# EAGLE design ArduinoProMiniESP2866Adapter (EAGLE 9.4.2)
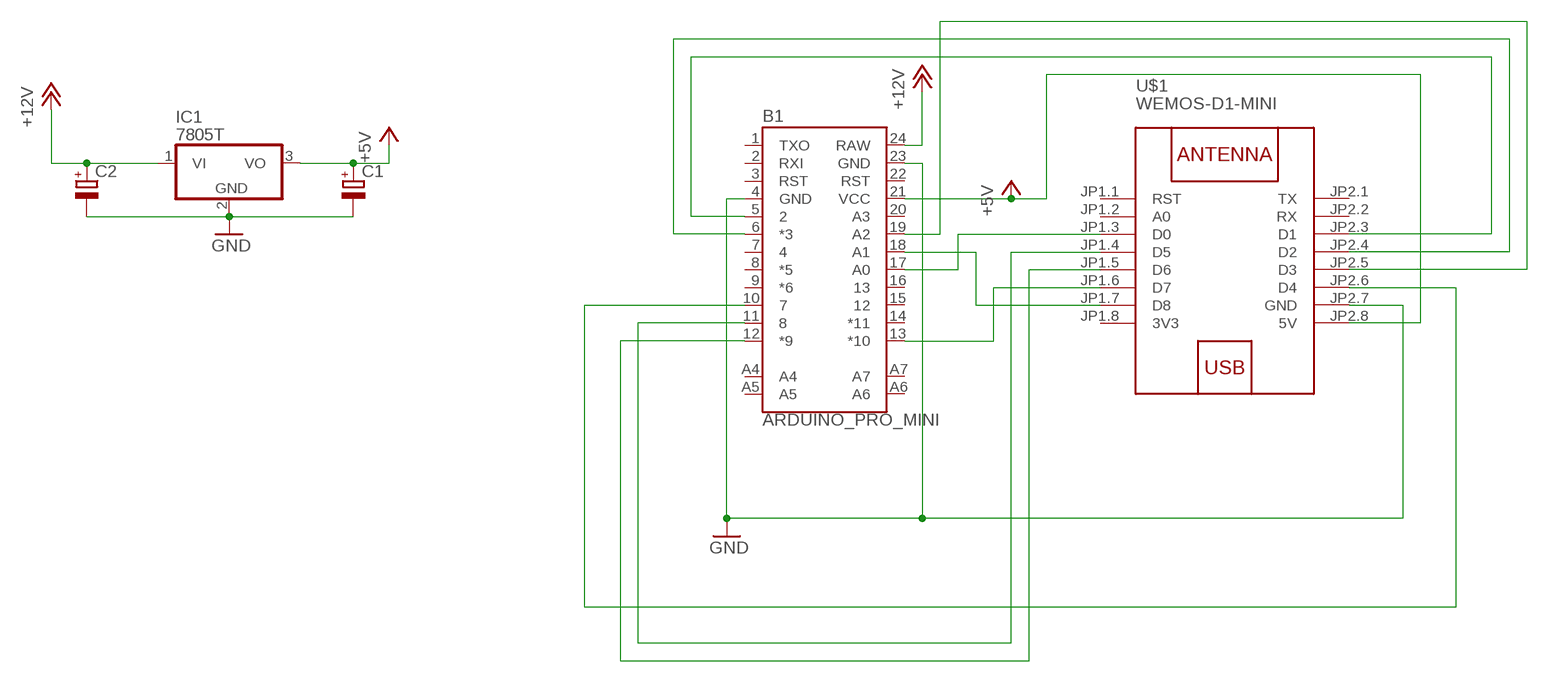
[diagram p0: schematic, sheet 1]

## Parts
B1  ARDUINO_PRO_MINI  [ARDUINO_PRO_MINI]
C1  CPOL-EUE2-4  [E2-4]
C2  CPOL-EUE2-4  [E2-4]
IC1  7805T  [TO220H]
U$1  WEMOS-D1-MINI  [WEMOS-D1-MINI]

## Nets
+5V: B1.21(VCC) C1.+ IC1.3(VO) U$1.JP2.8(5V)
+12V: B1.24(RAW) C2.+ IC1.1(VI)
GND: B1.4(GND) B1.23(GND) C1.- C2.- IC1.2(GND) U$1.JP2.7(GND)
N$1: B1.11 U$1.JP1.4(D5)
N$2: B1.12(*9) U$1.JP1.5(D6)
N$3: B1.13(*10) U$1.JP1.6(D7)
N$4: B1.5 U$1.JP2.3(D1)
N$5: B1.6(*3) U$1.JP2.4(D2)
N$6: B1.19(A2) U$1.JP2.5(D3)
N$7: B1.18(A1) U$1.JP1.7(D8)
N$8: B1.17(A0) U$1.JP1.3(D0)
N$9: B1.10 U$1.JP2.6(D4)
Unconnected: B1.1(TXO) B1.2(RXI) B1.3(RST) B1.7 B1.8(*5) B1.9(*6) B1.14(*11) B1.15 B1.16 B1.20(A3) B1.22(RST) B1.A4 B1.A5 B1.A6 B1.A7 U$1.JP1.1(RST) U$1.JP1.2(A0) U$1.JP2.1(TX) U$1.JP2.2(RX)

## Power pins joined to a net without a drawn wire
3V3: U$1.JP1.8(3V3)

## Library data of the parts
B1 = SparkFun-Boards:ARDUINO_PRO_MINI: SparkFun Pro Mini Pro Mini compatible footprint. Dimensions: 0.7 x 1.3" PCB Thickness: 0.8mm SparkFun Products: 3.3V/8MHz <https://www.sparkfun.com/products/11114> 5V/16MHz <https://www.sparkfun.com/products/11113>
C1 C2 = rcl:CPOL-EU: POLARIZED CAPACITOR, European symbol; SPICEPREFIX: C
IC1 = linear:78*: Positive VOLTAGE REGULATOR Source: http://cache.national.com/ds/LM/LM78L05.pdf http://www.fairchildsemi.com/ds/LM/LM7805.pdf
U$1 = diy-modules:WEMOS-D1-MINI: WEMOS D1 mini: Mini Wi-Fi Board based on ESP-8266 device More details can be found here: https://www.wemos.cc/product/d1-mini.html Click here to find device on ebay.com <http://www.ebay.com/sch/wemos+d1+mini+nodemcu>

## Board
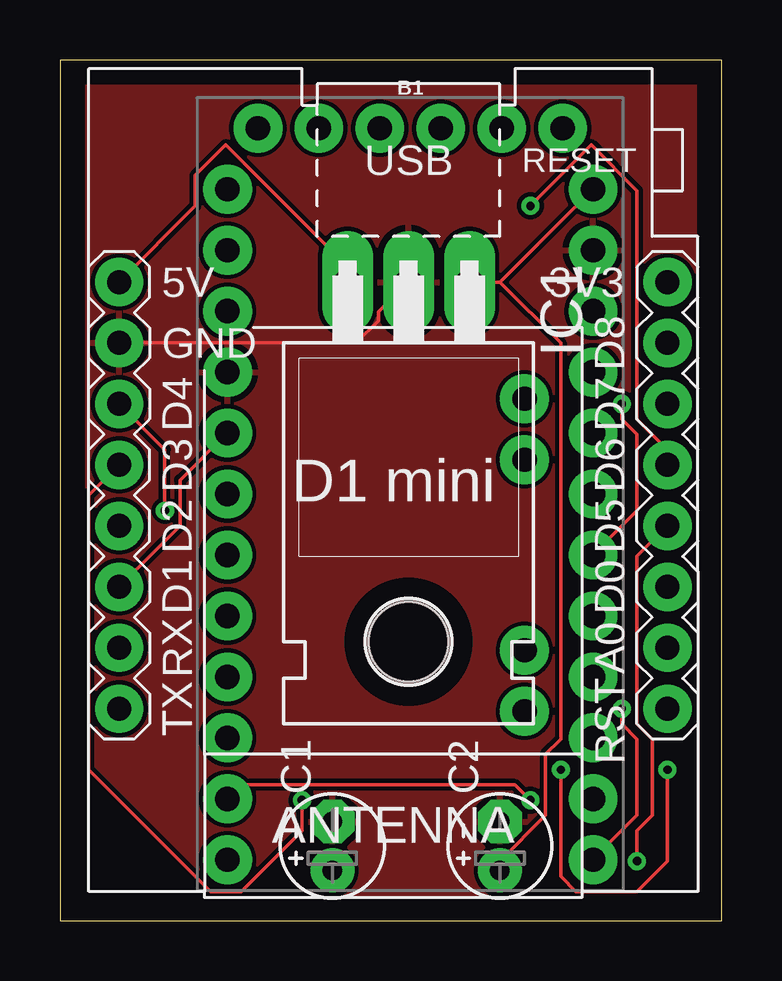
[diagram p1: board, top side]
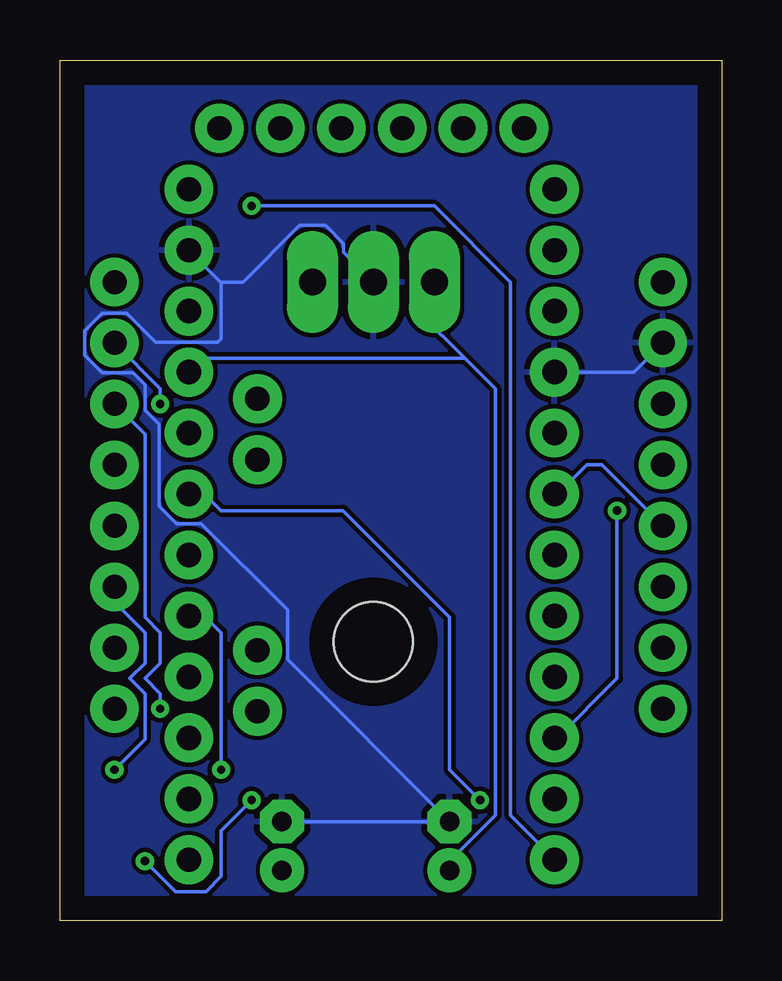
[diagram p2: board, bottom side, seen from below]

Size 27.6 x 35.86 mm. Coordinates in mm from the lower left corner, seen from the top.
Outline: 0,0 27.6,0 27.6,35.86 0,35.86 0,0
Copper layers (1*16): Top 0.035mm / dielectric 1.5mm / Bottom 0.035mm
Design rules "default *": minimum track width 6mil, minimum drill 0.35mm, track to track 7mil, track to pad 6mil, pad to pad 6mil, via to via 6mil, smd to smd 6mil, copper to edge 40mil, drill to drill 6mil, minimum pad ring 20mil, minimum via ring 8mil, stop-mask expansion 4mil, vias tented up to drill 0mil, thermal gap 10mil

### Footprints (pad centres in the part's own frame; a part is rotated, then mirrored left to right if it is on the bottom)
ARDUINO_PRO_MINI = drill 1.016 pad 1.88: 1 -7.62,12.7; 2 -7.62,10.16; 3 -7.62,7.62; 4 -7.62,5.08; 5 -7.62,2.54; 6 -7.62,0; 7 -7.62,-2.54; 8 -7.62,-5.08; 9 -7.62,-7.62; 10 -7.62,-10.16; 11 -7.62,-12.7; 12 -7.62,-15.24; 13 7.62,-15.24; 14 7.62,-12.7; 15 7.62,-10.16; 16 7.62,-7.62; 17 7.62,-5.08; 18 7.62,-2.54; 19 7.62,0; 20 7.62,2.54; 21 7.62,5.08; 22 7.62,7.62; 23 7.62,10.16; 24 7.62,12.7; A4 4.763,1.429; A5 4.763,3.969; A6 4.763,-9.049; A7 4.763,-6.509; BLK -6.35,15.24; GND -3.81,15.24; GRN 6.35,15.24; RXI 1.27,15.24; TXO 3.81,15.24; VCC -1.27,15.24
E2-4 = drill 0.813 pad 1.27: + -1.016,0 | drill 0.813 pad 1.27 octagon: - 1.016,0
TO220H = drill 1.118 long: 1 -2.54,-10.16; 2 0,-10.16; 3 2.54,-10.16 | hole 3.302: 0,4.826
WEMOS-D1-MINI = drill 1: JP1.1 -11.43,9.525; JP1.2 -11.43,6.985; JP1.3 -11.43,4.445; JP1.4 -11.43,1.905; JP1.5 -11.43,-0.635; JP1.6 -11.43,-3.175; JP1.7 -11.43,-5.715; JP1.8 -11.43,-8.255; JP2.1 11.43,9.525; JP2.2 11.43,6.985; JP2.3 11.43,4.445; JP2.4 11.43,1.905; JP2.5 11.43,-0.635; JP2.6 11.43,-3.175; JP2.7 11.43,-5.715; JP2.8 11.43,-8.255

### Placement (x,y rotation side)
B1  14.61,17.78 0 top
C1  11.36,3.12 90 top
C2  18.34,3.12 90 top
IC1  14.53,16.45 180 top
U$1  13.9,18.36 180 top

### Tracks (layer width: path | path; a pad name or v marks a point on that pad's centre or on a via)
+5V
  Top 0.152: 11.36,1.85 C1.+ | U$1.JP2.8 5.64,29.79 5.64,31.06 6.91,32.33 11.99,27.25 IC1.3
  Bottom 0.152: 12.63,25.34 11.99,25.98 IC1.3 12.63,25.34 | 12.63,25.34 10.72,23.44 | 10.72,23.44 9.45,22.17 9.45,4.39 11.36,2.48 C1.+ | 10.72,23.44 22.15,23.44 B1.21
+12V
  Top 0.152: 18.34,26.61 20.88,24.07 20.88,7.56 20.25,6.93 20.25,4.39 18.34,2.48 C2.+ | IC1.1 18.34,26.61 | 18.34,26.61 22.15,30.42 B1.24
  Bottom 0.152: 18.34,2.48 C2.+
GND
  Top 0.152: IC1.2 13.29,25.37 13.29,25.01 12.35,24.07 U$1.JP2.7
  Bottom 0.152: 14.53,25.98 IC1.2 15.78,27.86 15.78,28.22 16.54,28.98 17.61,28.98 19.97,26.61 20.88,26.61 | B1.23 20.9,26.61 20.88,26.61 | C2.- C1.- 18.12,10.9 18.12,12.95 21.71,16.53 22.74,16.53 23.47,17.26 23.47,20.69 24.06,21.27 24.06,22.33 24.56,22.84 25.84,22.84 26.57,23.56 26.57,24.59 25.84,25.31 24.82,25.31 23.61,24.1 21.04,24.1 20.88,24.26 20.88,26.61 | U$1.JP2.7 3.68,22.86 B1.4
  pour Bottom: 0.56,35.5 0.56,-0.06 27.23,-0.06 27.23,35.5
  pour Top: 0.56,35.5 0.56,0.58 1.83,-0.69 2.47,-0.06 27.23,-0.06 27.23,35.5
N$1  (via drill 0.35)
  Top 0.152: v24.06,2.48 24.06,3.75 24.69,4.39 24.69,7.56 24.06,8.2 24.06,15.18 U$1.JP1.4 | v19.61,5.02 18.98,5.66 7.55,5.66 B1.11
  Bottom 0.152: v19.61,5.02 20.88,3.75 20.88,1.85 21.52,1.21 22.79,1.21 v24.06,2.48
N$2  (via drill 0.35)
  Top 0.152: U$1.JP1.5 25.33,19.63 24.06,20.9 24.06,30.42 22.15,32.33 v19.61,29.79
  Bottom 0.152: v19.61,29.79 11.99,29.79 8.82,26.61 8.82,4.39 7.55,3.12 B1.12
N$3  (via drill 0.35)
  Top 0.152: v23.42,8.83 23.42,8.2 24.06,7.56 24.06,4.39 22.79,3.12 B1.13
  Bottom 0.152: U$1.JP1.6 24.06,20.26 24.06,12.64 23.42,12.01 23.42,10.74 24.06,10.1 23.42,9.47 v23.42,8.83
N$4
  Top 0.152: U$1.JP2.3 5.01,16.45 5.01,18.36 6.91,20.26 B1.5
  Bottom 0.152: 6.91,20.26 B1.5
N$5
  Bottom 0.152: U$1.JP2.4 5.01,18.99 5.64,18.99 6.91,17.72 B1.6
N$6  (via drill 0.35)
  Top 0.152: U$1.JP2.5 1.2,17.72 1.2,6.29 6.28,1.21 7.55,1.21 10.09,3.75 v10.09,5.02
  Bottom 0.152: v10.09,5.02 11.36,6.29 11.36,12.64 15.8,17.09 20.88,17.09 22.15,18.36 B1.19
N$7  (via drill 0.35)
  Top 0.152: v23.42,21.53 23.42,20.9 24.06,20.26 24.06,17.09 22.79,15.82 B1.18
  Bottom 0.152: 22.79,15.82 B1.18 | U$1.JP1.7 23.42,22.17 v23.42,21.53
N$8  (via drill 0.35)
  Top 0.152: v25.33,6.29 25.33,2.48 24.06,1.21 21.52,1.21 20.88,1.85 v20.88,6.29
  Bottom 0.152: U$1.JP1.3 25.33,13.28 24.06,12.01 24.06,10.74 24.69,10.1 24.06,9.47 24.06,7.56 v25.33,6.29 | v20.88,6.29 20.88,12.01 22.15,13.28 B1.17
N$9  (via drill 0.35)
  Top 0.152: U$1.JP2.6 4.37,19.63 v4.37,17.09
  Bottom 0.152: v4.37,17.09 4.37,10.1 6.91,7.56 B1.10

### Text on the board
tValues: ClosedLoopStepMotorBoard 0.12 | https://github.com/arttupii/CLSMB.git